# Altium schematic sheet isp.SchDoc: isp
size 453 x 317 mm; Origin: Eagle; Date: 5/8/2023 8:16:00 AM; SheetNumber: 1; GateName_1: G$1; SymbolName_1: FRAME_B_L; LibraryName: frames; DeviceSetName: FRAME_B_L; GateName_2: G$2; SymbolName_2: DOCFIELD; Sheet: Sheet:; REV: REV:
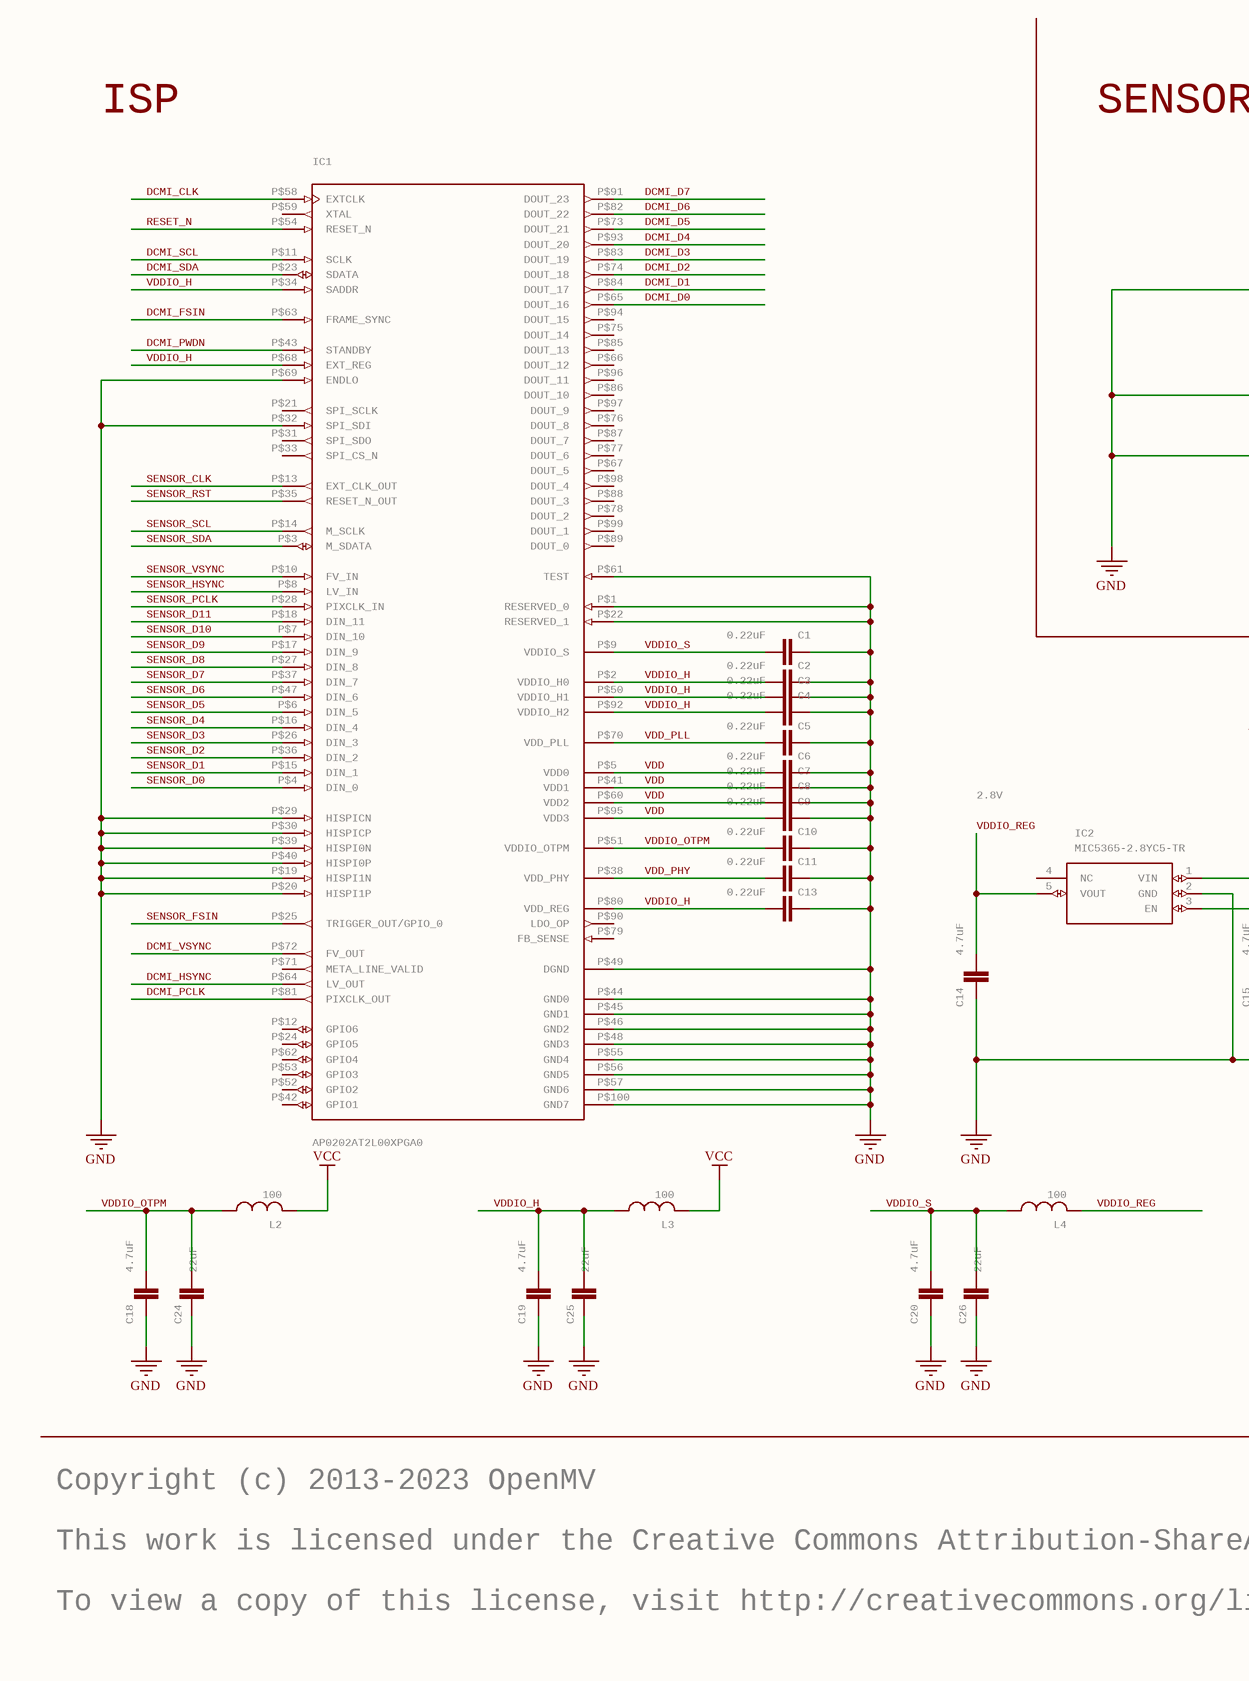
[diagram p0: isp.SchDoc, left]
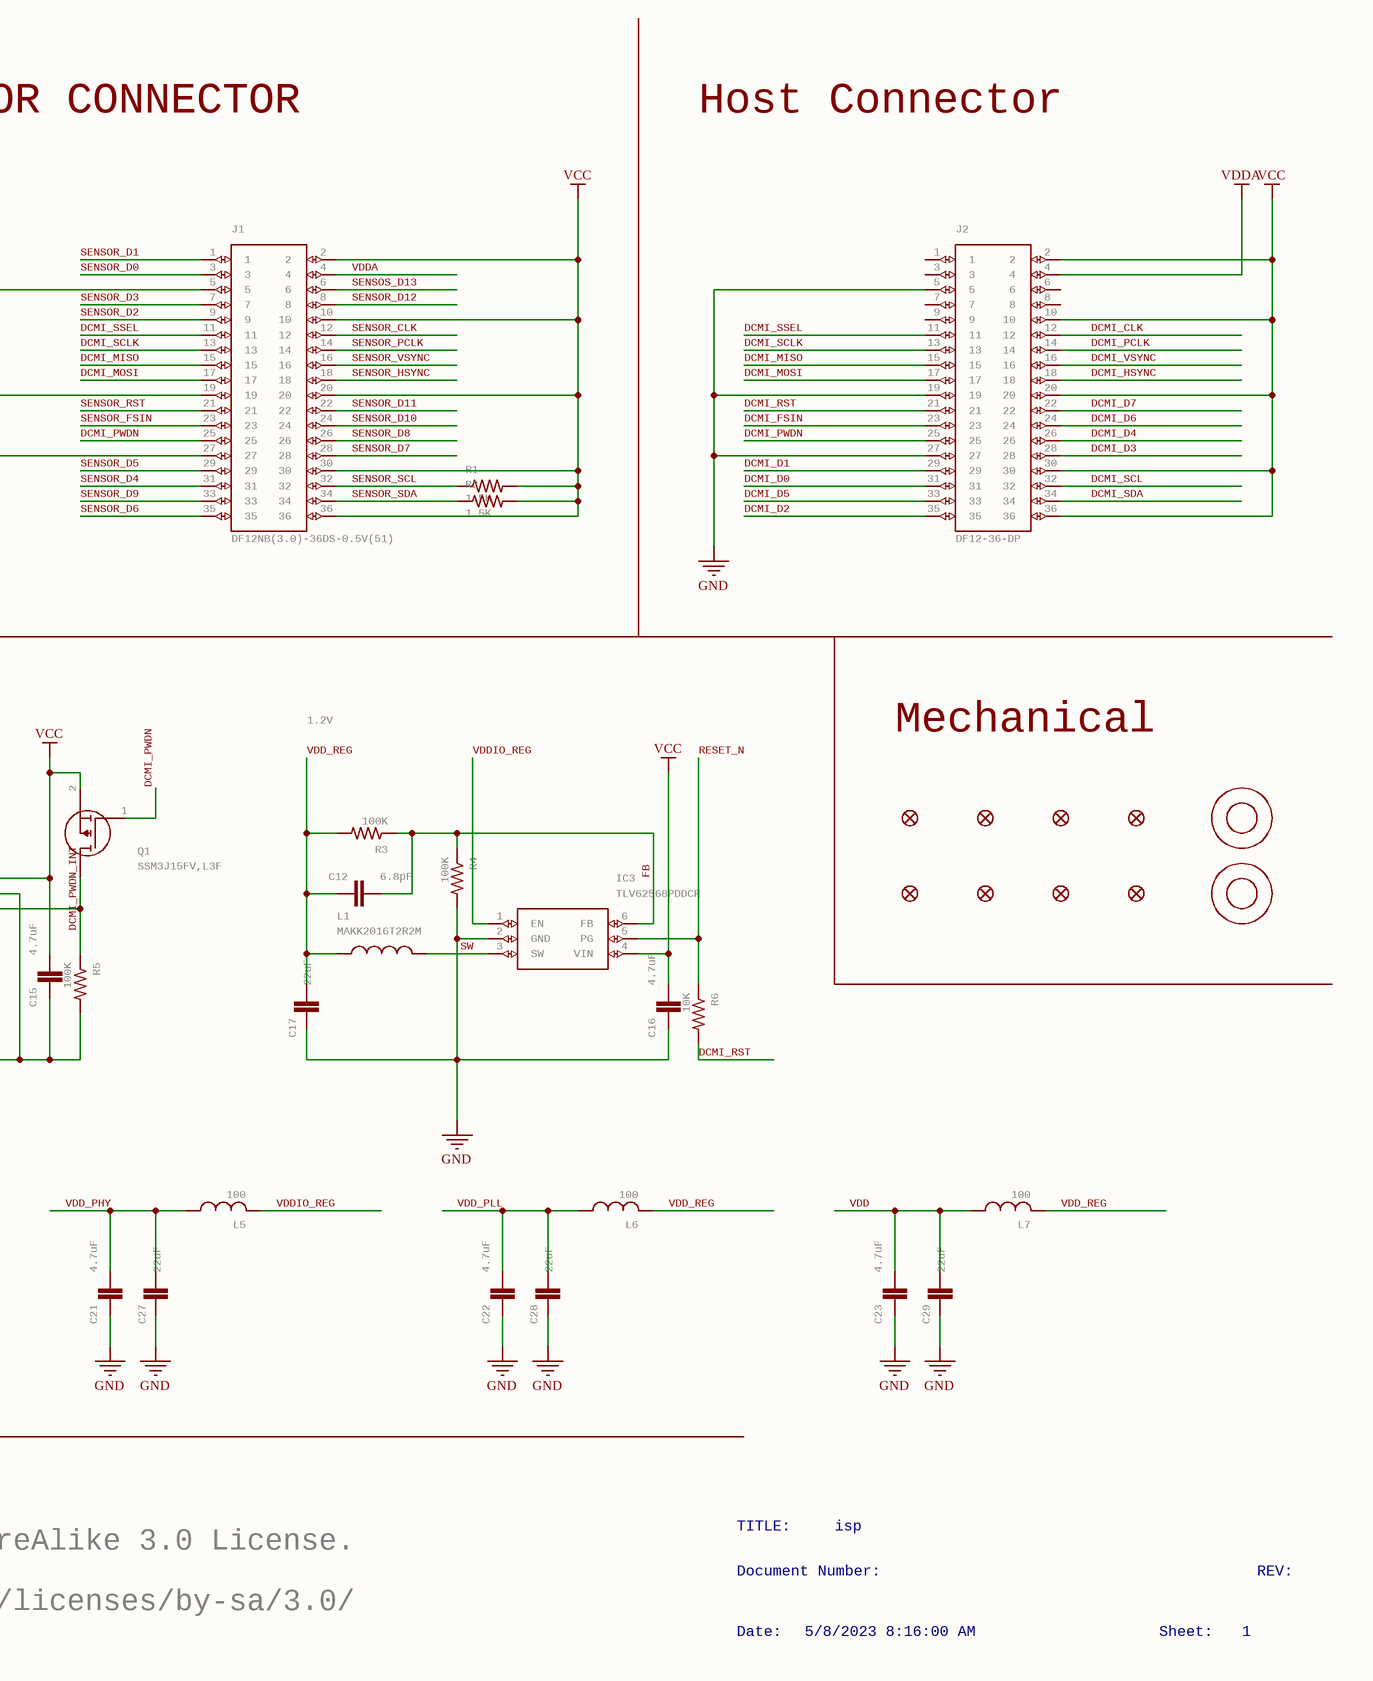
[diagram p1: isp.SchDoc, right]

## Parts
C1  0.22uF  [C0201]
C2  0.22uF  [C0201]
C3  0.22uF  [C0201]
C4  0.22uF  [C0201]
C5  0.22uF  [C0201]
C6  0.22uF  [C0201]
C7  0.22uF  [C0201]
C8  0.22uF  [C0201]
C9  0.22uF  [C0201]
C10  0.22uF  [C0201]
C11  0.22uF  [C0201]
C12  6.8pF  [0402]
C13  0.22uF  [C0201]
C14  4.7uF  [0402]
C15  4.7uF  [0402]
C16  4.7uF  [0402]
C17  22uF  [0805]
C18  4.7uF  [0402]
C19  4.7uF  [0402]
C20  4.7uF  [0402]
C21  4.7uF  [0402]
C22  4.7uF  [0402]
C23  4.7uF  [0402]
C24  22uF  [0805]
C25  22uF  [0805]
C26  22uF  [0805]
C27  22uF  [0805]
C28  22uF  [0805]
C29  22uF  [0805]
FD1  FIDUCIAL1X2  [FIDUCIAL-1X2]  (value not drawn)
FD2  FIDUCIAL1X2  [FIDUCIAL-1X2]  (value not drawn)
FD3  FIDUCIAL1X2  [FIDUCIAL-1X2]  (value not drawn)
FD4  FIDUCIAL1X2  [FIDUCIAL-1X2]  (value not drawn)
FD5  FIDUCIAL1X2  [FIDUCIAL-1X2]  (value not drawn)
FD6  FIDUCIAL1X2  [FIDUCIAL-1X2]  (value not drawn)
FD7  FIDUCIAL1X2  [FIDUCIAL-1X2]  (value not drawn)
FD8  FIDUCIAL1X2  [FIDUCIAL-1X2]  (value not drawn)
IC1  AP0202AT2L00XPGA0  [AP0202AT2L00XPGA0]
IC2  MIC5365-2.8YC5-TR  [SOT65P210X110-5N]
IC3  TLV62568PDDCR  [SOT95P280X110-6N]
J1  DF12NB(3.0)-36DS-0.5V(51)  [DF12-36-DS]
J2  DF12-36-DP  [DF12-36-DP]
L1  MAKK2016T2R2M  [INDC2016X100N]
L2  100  [0402]
L3  100  [0402]
L4  100  [0402]
L5  100  [0402]
L6  100  [0402]
L7  100  [0402]
M1  9774030151R  [9774030243R]  (value not drawn)
M2  9774030151R  [9774030243R]  (value not drawn)
Q1  SSM3J15FV,L3F  [SSM3J15FV]
R1  1.5K  [R0402]
R2  1.5K  [R0402]
R3  100K  [R0402]
R4  100K  [R0402]
R5  100K  [R0402]
R6  10K  [R0402]

## Nets
GND: C1.1 C2.1 C3.1 C4.1 C5.1 C6.1 C7.1 C8.1 C9.1 C10.1 C11.1 C13.1 C14.1 C15.1 C16.1 C17.1 C18.1 C19.1 C20.1 C21.1 C22.1 C23.1 C24.1 C25.1 C26.1 C27.1 C28.1 C29.1 IC1.P$1(RESERVED_0) IC1.P$19(HISPI1N) IC1.P$20(HISPI1P) IC1.P$22(RESERVED_1) IC1.P$29(HISPICN) IC1.P$30(HISPICP) IC1.P$32(SPI_SDI) IC1.P$39(HISPI0N) IC1.P$40(HISPI0P) IC1.P$44(GND0) IC1.P$45(GND1) IC1.P$46(GND2) IC1.P$48(GND3) IC1.P$49(DGND) IC1.P$55(GND4) IC1.P$56(GND5) IC1.P$57(GND6) IC1.P$61(TEST) IC1.P$69(ENDLO) IC1.P$100(GND7) IC2.2(GND) IC3.2(GND) J1.5 J1.19 J1.27 J2.5 J2.19 J2.27 R4.2 R5.2
VCC: C15.2 C16.2 IC2.1(VIN) IC3.4(VIN) J1.2 J1.10 J1.20 J1.30 J1.36 J2.2 J2.10 J2.20 J2.30 J2.36 L2.2(P$2) L3.2(P$2) Q1.2(S) R1.2 R2.2
VDDA: J1.4 J2.4
DCMI_CLK: IC1.P$58(EXTCLK) J2.12
DCMI_D0: IC1.P$65(DOUT_16) J2.31
DCMI_D1: IC1.P$84(DOUT_17) J2.29
DCMI_D2: IC1.P$74(DOUT_18) J2.35
DCMI_D3: IC1.P$83(DOUT_19) J2.28
DCMI_D4: IC1.P$93(DOUT_20) J2.26
DCMI_D5: IC1.P$73(DOUT_21) J2.33
DCMI_D6: IC1.P$82(DOUT_22) J2.24
DCMI_D7: IC1.P$91(DOUT_23) J2.22
DCMI_FSIN: IC1.P$63(FRAME_SYNC) J2.23
DCMI_HSYNC: IC1.P$64(LV_OUT) J2.18
DCMI_MISO: J1.15 J2.15
DCMI_MOSI: J1.17 J2.17
DCMI_PCLK: IC1.P$81(PIXCLK_OUT) J2.14
DCMI_PWDN: IC1.P$43(STANDBY) J1.25 J2.25 Q1.1(G)
DCMI_PWDN_INT: IC2.3(EN) Q1.3(D) R5.1
DCMI_RST: J2.21 R6.2
DCMI_SCL: IC1.P$11(SCLK) J2.32
DCMI_SCLK: J1.13 J2.13
DCMI_SDA: IC1.P$23(SDATA) J2.34
DCMI_SSEL: J1.11 J2.11
DCMI_VSYNC: IC1.P$72(FV_OUT) J2.16
FB: C12.2 IC3.6(FB) R3.1 R4.1
RESET_N: IC1.P$54(RESET_N) IC3.5(PG) R6.1
SENSOR_CLK: IC1.P$13(EXT_CLK_OUT) J1.12
SENSOR_D0: IC1.P$4(DIN_0) J1.3
SENSOR_D1: IC1.P$15(DIN_1) J1.1
SENSOR_D2: IC1.P$36(DIN_2) J1.9
SENSOR_D3: IC1.P$26(DIN_3) J1.7
SENSOR_D4: IC1.P$16(DIN_4) J1.31
SENSOR_D5: IC1.P$6(DIN_5) J1.29
SENSOR_D6: IC1.P$47(DIN_6) J1.35
SENSOR_D7: IC1.P$37(DIN_7) J1.28
SENSOR_D8: IC1.P$27(DIN_8) J1.26
SENSOR_D9: IC1.P$17(DIN_9) J1.33
SENSOR_D10: IC1.P$7(DIN_10) J1.24
SENSOR_D11: IC1.P$18(DIN_11) J1.22
SENSOR_D12: J1.8
SENSOR_FSIN: IC1.P$25(TRIGGER_OUT/GPIO_0) J1.23
SENSOR_HSYNC: IC1.P$8(LV_IN) J1.18
SENSOR_PCLK: IC1.P$28(PIXCLK_IN) J1.14
SENSOR_RST: IC1.P$35(RESET_N_OUT) J1.21
SENSOR_SCL: IC1.P$14(M_SCLK) J1.32 R1.1
SENSOR_SDA: IC1.P$3(M_SDATA) J1.34 R2.1
SENSOR_VSYNC: IC1.P$10(FV_IN) J1.16
SENSOS_D13: J1.6
SW: IC3.3(SW) L1.2
VDD: C6.2 C7.2 C8.2 C9.2 C23.2 C29.2 IC1.P$5(VDD0) IC1.P$41(VDD1) IC1.P$60(VDD2) IC1.P$95(VDD3) L7.1(P$1)
VDD_PHY: C11.2 C21.2 C27.2 IC1.P$38(VDD_PHY) L5.1(P$1)
VDD_PLL: C5.2 C22.2 C28.2 IC1.P$70(VDD_PLL) L6.1(P$1)
VDD_REG: C12.1 C17.2 L1.1 L6.2(P$2) L7.2(P$2) R3.2
VDDIO_H: C2.2 C3.2 C4.2 C13.2 C19.2 C25.2 IC1.P$2(VDDIO_H0) IC1.P$34(SADDR) IC1.P$50(VDDIO_H1) IC1.P$68(EXT_REG) IC1.P$80(VDD_REG) IC1.P$92(VDDIO_H2) L3.1(P$1)
VDDIO_OTPM: C10.2 C18.2 C24.2 IC1.P$51(VDDIO_OTPM) L2.1(P$1)
VDDIO_REG: C14.2 IC2.5(VOUT) IC3.1(EN) L4.2(P$2) L5.2(P$2)
VDDIO_S: C1.2 C20.2 C26.2 IC1.P$9(VDDIO_S) L4.1(P$1)

Not connected (* = marked no-connect by the designer): IC1 P$12(GPIO6) P$21(SPI_SCLK) P$24(GPIO5) P$31(SPI_SDO) P$33(SPI_CS_N) P$42(GPIO1) P$52(GPIO2) P$53(GPIO3) P$59(XTAL) P$62(GPIO4) P$66(DOUT_12) P$67(DOUT_5) P$71(META_LINE_VALID) P$75(DOUT_14) P$76(DOUT_8) P$77(DOUT_6) P$78(DOUT_2) P$79(FB_SENSE) P$85(DOUT_13) P$86(DOUT_10) P$87(DOUT_7) P$88(DOUT_3) P$89(DOUT_0) P$90(LDO_OP) P$94(DOUT_15) P$96(DOUT_11) P$97(DOUT_9) P$98(DOUT_4) P$99(DOUT_1); IC2 4(NC); J2 1 3 6 7 8 9

## Notes on the sheet
- ISP
- SENSOR CONNECTOR
- Host Connector
- 1.2V
- Mechanical
- 2.8V
- Copyright (c) 2013-2023 OpenMV
- TITLE:
- isp
- This work is licensed under the Creative Commons Attribution-ShareAlike 3.0 License.
- To view a copy of this license, visit http://creativecommons.org/licenses/by-sa/3.0/
- Document Number:
- REV:
- Date:
- 5/8/2023 8:16:00 AM
- Sheet:
- 1

## Library data of the parts
C1-C11 C13 = C-EUC0201: CAPACITOR, European symbol; MPN: GRM033R60J224ME15D; GateName_1: G$1; SymbolName_1: C-EU; POPULARITY: 0; DeviceName: C0201; LibraryName: rcl; DeviceSetName: C-EU; SPICEPREFIX: C
C12 = CAP_0402: 0402 (1005 Metric) Nick Garner - TeleSense; MPN: GRM1555C1H6R8DA01D; GateName_1: G$1; SymbolName_1: CAP; LibraryName: 0402; DeviceSetName: CAP_0402
C14-C16 C18-C23 = CAP_0402: 0402 (1005 Metric) Nick Garner - TeleSense; MPN: JMK105BBJ475MV-F; GateName_1: G$1; SymbolName_1: CAP; LibraryName: 0402; DeviceSetName: CAP_0402
C17 C24-C29 = 22UF-0805-6.3V-20%: 22ÂµF ceramic capacitors    A capacitor is a passive two-terminal electrical component used to store electrical energy temporarily in an electric field.; MPN: CL21A226MQQNNNE; GateName_1: G$1; SymbolName_1: CAP; PROD_ID: CAP-08402; DeviceName: -0805-6.3V-20%; LibraryName: SparkFun-Capacitors; DeviceSetName: 22UF
FD1-FD8 = FIDUCIAL1X2: Fiducial Alignment Points    Point-of-reference for pick-and-place machines and other optical instruments.; GateName_1: G$1; DeviceName: 1X2; SymbolName_1: FIDUCIAL; LibraryName: SparkFun-Aesthetics; DeviceSetName: FIDUCIAL
IC1 = AP0202AT2L00XPGA0: MPN: AP0202AT2L00XPGA0-DR; GateName_1: G$1; SymbolName_1: AP0202AT2L00XPGA0; LibraryName: AP0202AT2L00XPGA0; DeviceSetName: AP0202AT2L00XPGA0
IC2 = MIC5365-2.8YC5-TR: IC REG LINEAR 2.8V 150MA SC70-5   Source:  Datasheet; MANUFACTURER_NAME: Microchip; GateName_1: G$1; SymbolName_1: MIC5365-2.8YC5-TR; LibraryName: MIC5365-2.8YC5-TR; DeviceSetName: MIC5365-2.8YC5-TR; HEIGHT: 1.1mm; MANUFACTURER_PART_NUMBER: MIC5365-2.8YC5-TR; MOUSER_PART_NUMBER: 998-MIC5365-2.8YC5TR; MOUSER_PRICE-STOCK: https://www.mouser.co.uk/ProductDetail/Microchip-Technology-Atmel/MIC5365-2.8YC5-TR?qs=U6T8BxXiZAX3mJDSWJyjVA%3D%3D; MPN: MIC5365-2.8YC5-TR
IC3 = TLV62568PDDCR: 2.5V-5.5V input, 1A high efficiency step-down buck converter in SOT23 and SOT563 package   Source:  Datasheet; MANUFACTURER_NAME: Texas Instruments; GateName_1: G$1; SymbolName_1: TLV62568PDDCR; LibraryName: TLV62568PDDCR; DeviceSetName: TLV62568PDDCR; HEIGHT: 1.1mm; MANUFACTURER_PART_NUMBER: TLV62568PDDCR; MOUSER_PART_NUMBER: 595-TLV62568PDDCR; MOUSER_PRICE-STOCK: https://www.mouser.co.uk/ProductDetail/Texas-Instruments/TLV62568PDDCR?qs=1mbolxNpo8f1FPchIXcxyQ%3D%3D; MPN: TLV62568PDDCR
J1 = DF12-36-DS: GateName_1: G$1; SymbolName_1: DF12-36; LibraryName: DF12-36-DS; DeviceSetName: DF12-36-DS; MPN: DF12NB(3.0)-36DS-0.5V(51)
J2 = DF12-36-DP: MPN: DF12NB(3.0)-36DP-0.5V(51); GateName_1: G$1; SymbolName_1: DF12-36; LibraryName: DF12NB(3.0)-36DP-0.5V(51); DeviceSetName: DF12-36-DP
L1 = MAKK2016T2R2M: INDUCTOR, METAL CORE Check availability; GateName_1: G$1; MF: Taiyo Yuden; SymbolName_1: MAKK2016T2R2M; LibraryName: MAKK2016T2R2M; DeviceSetName: MAKK2016T2R2M; AVAILABILITY: In Stock; MP: MAKK2016T2R2M; MPN: MAKK2016T2R2M; PACKAGE: 2016 Taiyo Yuden; PRICE: None; PURCHASE-URL: https://pricing.snapeda.com/search/part/MAKK2016T2R2M/?ref=eda
L2-L7 = INDUCTOR_0402: MPN: MFBM1V1005-101-R; GateName_1: G$1; SymbolName_1: INDUCTOR; LibraryName: 0402; DeviceSetName: INDUCTOR_0402
M1 M2 = 9774030151R: GateName_1: G$1; SymbolName_1: 9774030151R; LibraryName: 9774030151R; DeviceSetName: 9774030151R; MPN: 9774030151R
Q1 = PMXB120EPEZ: MOSFET 30 V, P-channel Trench MOSFET   Source:  Datasheet; GateName_1: G$1; SymbolName_1: SSM3J15FV,L3F; LibraryName: SSM3J15FV,L3F; DeviceSetName: SSM3J15FV,L3F; HEIGHT: 0.4mm; MANUFACTURER_PART_NUMBER: SSM3J15FV,L3F; MPN: SSM3J15FV,L3F
R1 R2 = R-US_R0402: RESISTOR, American symbol; MPN: RC0402FR-131K5L; GateName_1: G$1; SymbolName_1: R-US; DeviceSetName: R-US_; POPULARITY: 34; DeviceName: R0402; LibraryName: rcl; SPICEPREFIX: R
R3-R5 = R-US_R0402: RESISTOR, American symbol; MPN: AC0402FR-07100KL; GateName_1: G$1; SymbolName_1: R-US; DeviceSetName: R-US_; POPULARITY: 34; DeviceName: R0402; LibraryName: rcl; SPICEPREFIX: R
R6 = R-US_R0402: RESISTOR, American symbol; MPN: AC0402FR-1310KL; GateName_1: G$1; SymbolName_1: R-US; DeviceSetName: R-US_; POPULARITY: 34; DeviceName: R0402; LibraryName: rcl; SPICEPREFIX: R